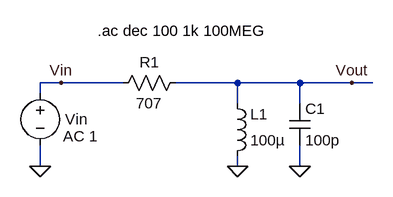
[diagram p0: schematic _Fig3_40_MSD.asc]
_Fig3_40_MSD.asc, the LTspice schematic file:
Version 4
SHEET 1 2740 696
WIRE 432 -336 432 -352
WIRE 432 -224 432 -256
WIRE 464 -352 432 -352
WIRE 560 -352 464 -352
WIRE 736 -352 640 -352
WIRE 736 -320 736 -352
WIRE 736 -224 736 -240
WIRE 832 -352 736 -352
WIRE 832 -320 832 -352
WIRE 832 -224 832 -256
WIRE 912 -352 832 -352
WIRE 944 -352 912 -352
FLAG 432 -224 0
FLAG 832 -224 0
FLAG 912 -352 Vout
FLAG 464 -352 Vin
FLAG 736 -224 0
SYMBOL voltage 432 -352 R0
WINDOW 0 38 56 Left 0
WINDOW 123 35 82 Left 0
WINDOW 39 0 0 Left 0
SYMATTR InstName Vin
SYMATTR Value2 AC 1
SYMATTR Value ""
SYMBOL ind 720 -224 M180
WINDOW 0 36 80 Left 0
WINDOW 3 36 40 Left 0
SYMATTR InstName L1
SYMATTR Value 100µ
SYMBOL res 544 -336 R270
WINDOW 0 32 56 VTop 0
WINDOW 3 0 56 VBottom 0
SYMATTR InstName R1
SYMATTR Value 707
SYMBOL cap 816 -320 R0
SYMATTR InstName C1
SYMATTR Value 100p
TEXT 520 -432 Left 0 !.ac dec 100 1k 100MEG

The netlist it stands for:
* _Fig3_40_MSD.asc
Vin Vin 0 AC 1
L1 0 Vout 100µ
R1 Vin Vout 707
C1 Vout 0 100p
.ac dec 100 1k 100MEG
.backanno
.end